# Altium schematic sheet Sheet1.SchDoc
size 209 x 297 mm; Author: ALTIUM GOSTBOM2.0 KEV; SheetNumber: 1; SheetTotal: 1
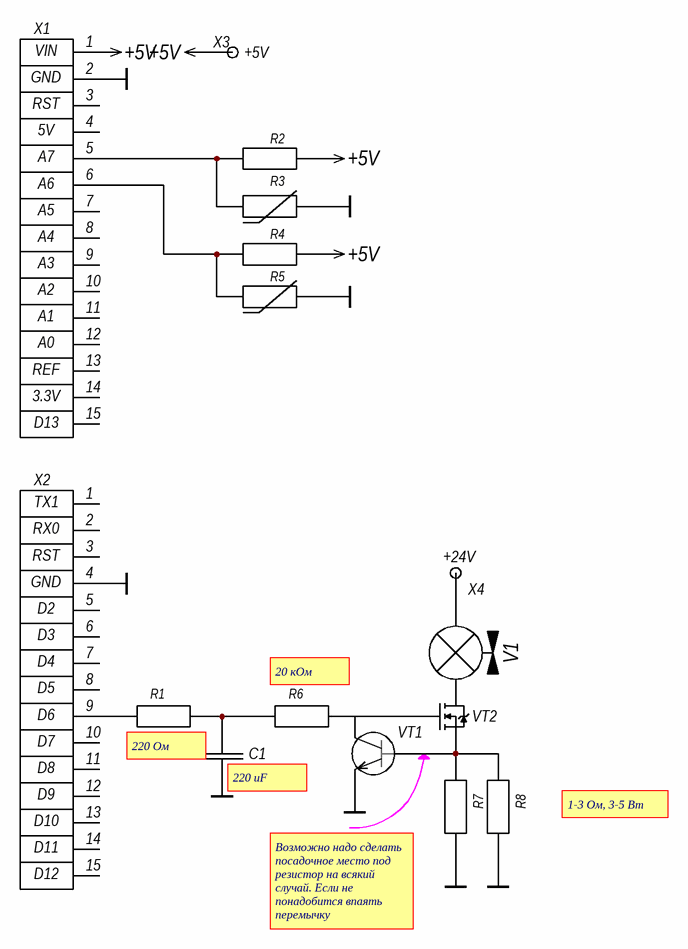
[diagram p0: Sheet1.SchDoc]

## Parts
C1  Ceramic AVX  [0805]  (value not drawn)
R1  Р1-8В-0,75-220 Ом  [R-1206-0.25Вт]  (value not drawn)
R2  Р1-8В 20 кОм  [R-1206-0.25Вт]  (value not drawn)
R3  B57861S0303F045  [Вилка на плату]  (value not drawn)
R4  Р1-8В 20 кОм  [R-1206-0.25Вт]  (value not drawn)
R5  B57861S0303F045  [Вилка на плату]  (value not drawn)
R6  Р1-8В-0,75-20 кОм  [R-1206-0.25Вт]  (value not drawn)
R7  Р1-8В-2-3 Ом  [R-4020-2.0Вт]  (value not drawn)
R8  Р1-8В-2-3 Ом  [R-4020-2.0Вт]  (value not drawn)
V1  Обозначение при заказе  [Вилка на плату]  (value not drawn)
VT1  C33740  [Transistor]  (value not drawn)
VT2  IRF530N  [MOSFET]  (value not drawn)
X1  SOCKET  [SOCKET]  (value not drawn)
X2  SOCKET  [SOCKET]  (value not drawn)
X3  +5V  [Вилка на плату]  (no BOM)
X4  +24V  [Вилка на плату]  (no BOM)

## Nets
+5V: R2.1 R4.1 X1.1 X3.1
GND: C1.2 R3.2 R5.2 R7.2 R8.2 VT1.1(E) X1.2 X2.4
NetC1_1: C1.1 R1.2 R6.1
NetR1_1: R1.1 X2.9
NetR2_2: R2.2 R3.1 X1.5
NetR4_2: R4.2 R5.1 X1.6
NetR6_2: R6.2 VT1.3(C) VT2.1(G)
NetR7_1: R7.1 R8.1 VT1.2(B) VT2.3(S)
NetV1_1: V1.1 X4.1
NetV1_2: V1.2 VT2.2(D)

Not connected (* = marked no-connect by the designer): X1 3 4 7 8 9 10 11 12 13 14 15; X2 1 2 3 5 6 7 8 10 11 12 13 14 15

## Notes on the sheet
- (near X1) VIN
- (near X1) GND
- (near X1) RST
- (near X1) 5V
- (near X1) A7
- (near X1) A6
- (near X1) A5
- (near X1) A4
- (near X1) A3
- (near X1) A2
- (near X1) A1
- (near X1) A0
- (near X1) REF
- (near X1) 3.3V
- (near X1) D13
- (near X2) TX1
- (near X2) RX0
- (near X2) RST
- (near X2) GND
- (near X2) D2
- (near X2) D3
- (near X2) D4
- (near X2) D5
- (near X2) D6
- (near R6) 20 кОм
- (near X2) D7
- (near X2) D8
- (near X2) D9
- 220 Ом
- (near C1) 220 uF
- 1-3 Ом, 3-5 Вт
- (near X2) D10
- (near X2) D11
- (near X2) D12
- Возможно надо сделать посадочное место под резистор на всякий случай. Если не понадобится впаять перемычку
- Перв. примен.
- Справ. №
- Подп. дата
- Инв. № дубл.
- Взам. инв. №
- Подп. и дата
- Изм.
- Разраб.
- Лист
- № докум.
- Подп.
- Дата
- Лит.
- Масса
- Масштаб
- Пров.
- Т.контр.
- Листов
- Инв. № подл.
- Н.контр.
- Утв.
- Файл:
- ALTIUM GOSTBOM2.0 KEV
- Копировал
- Формат А4

## Library data of the parts
C1 = Ceramic AVX: Конденсатор керамический; Примечание: Epcos; Наименование: https://www.chipdip.ru/product0/8008632183
R1 R2 R4 R6 = R1-8B: Резистор; Примечание: *
  R1: Наименование: Р1-8В-0,75-220 Ом
  R2 R4: Наименование: Р1-8В 20 кОм
  R6: Наименование: Р1-8В-0,75-20 кОм
R3 R5 = Термистор: Резистор; Наименование: B57861S0303F045; Примечание: *
R7 R8 = R1-8B: Резистор; Примечание: 2.0,2.4,2.7,3.6,3.9; Наименование: Р1-8В-2-3 Ом
V1 = VALVE: Описание свойств компонента; Наименование: PVQ31-5G-16-01-?-?-F
VT1 = 2T665A91: Транзистор N-P-N; Наименование: C33740; Примечание: *
VT2 = MOSFET: Наименование: IRF530N
X1 X2 = SOCKET: Наименование: PBS2-15; Примечание: DS1026-01 -1x15
X3 X4 = Контакт отверстие: Наименование: PBS-2; Примечание: DS1023-1x2